# Altium schematic sheet BUS.schdoc: TITRE
size Letter; ApprovedBy: APPROUVÉ PAR; Organization: Cegep Limoilou; Address1: 1300, 8e Avenue; Address2: Québec, QC; Address3: Canada; Address4: G1J 5L5; SheetNumber: 1; SheetTotal: 6
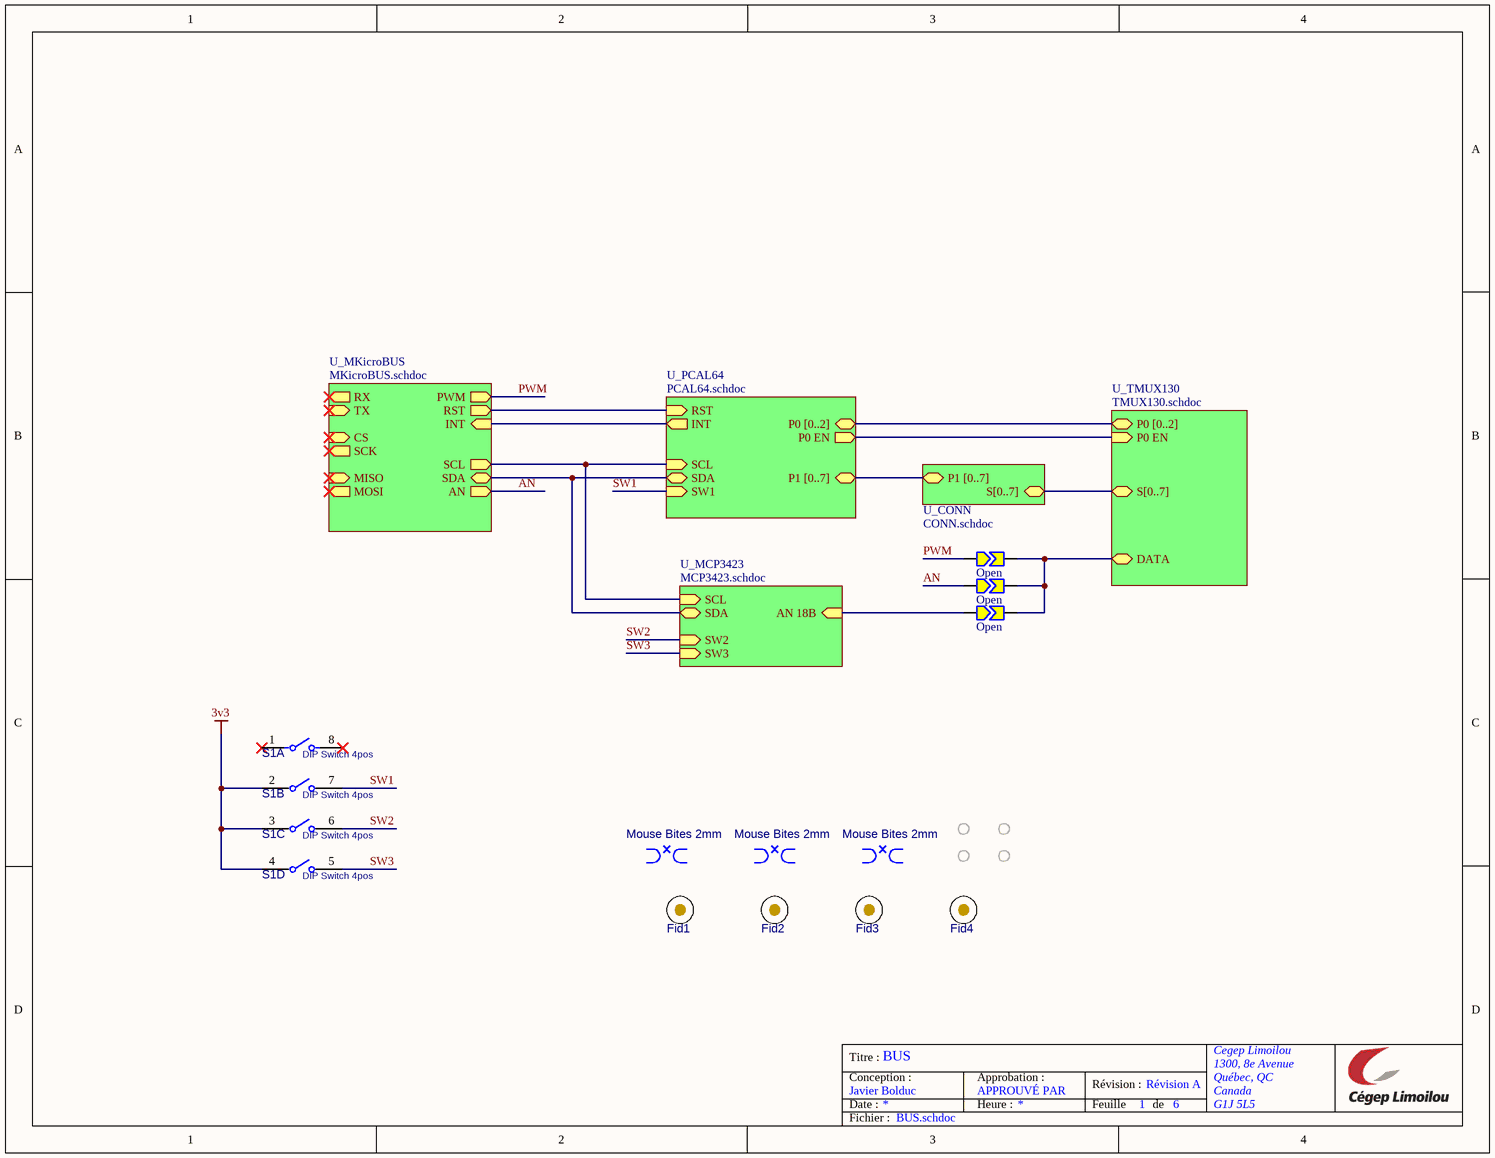
[diagram p0: BUS.schdoc]

## Parts
BRK1  value Mouse Bites 2mm  [BK_CRACK1B_M]  (hidden comment: DNP)  (no BOM)
BRK3  value Mouse Bites 2mm  [BK_CRACK1B_M]  (hidden comment: DNP)  (no BOM)
BRK4  value Mouse Bites 2mm  [BK_CRACK1B_M]  (hidden comment: DNP)  (no BOM)
Fid1  DNP  [FD_Fiducial]  (value not drawn)  (no BOM)
Fid2  DNP  [FD_Fiducial]  (value not drawn)  (no BOM)
Fid3  DNP  [FD_Fiducial]  (value not drawn)  (no BOM)
Fid4  DNP  [FD_Fiducial]  (value not drawn)  (no BOM)
MH1  DNP  [MP_M-Hole_M2-NonPlated]  (value not drawn)  (no BOM)
MH2  DNP  [MP_M-Hole_M2-NonPlated]  (value not drawn)  (no BOM)
MH3  DNP  [MP_M-Hole_M2-NonPlated]  (value not drawn)  (no BOM)
MH4  DNP  [MP_M-Hole_M2-NonPlated]  (value not drawn)  (no BOM)
S1  value DIP Switch 4pos  [S_DIP_SWITCH_50MIL_4POS]  (hidden comment: DSHP04TSGER)  (parts A,B,C,D of 4)
SB1  Open  [SB-TINY-OPEN]  (no BOM)
SB2  Open  [SB-TINY-OPEN]  (no BOM)
SB3  Open  [SB-TINY-OPEN]  (no BOM)

## Sub-sheets
U_CONN = CONN.schdoc: S[0..7] (bidir), P1 [0..7] (bidir)
U_MCP3423 = MCP3423.schdoc: AN 18B (in), SDA (bidir), SCL (in), SW2 (in), SW3 (in)
U_MKicroBUS = MKicroBUS.schdoc: AN (out), INT (in), RST (out), SDA (bidir), SCL (out), MOSI (out), MISO (in), RX (out), TX (in), CS (in), SCK (out), PWM (out)
U_PCAL64 = PCAL64.schdoc: P1 [0..7] (bidir), RST (in), INT (out), SDA (bidir), P0 [0..2] (bidir), P0 EN (out), SCL (in), SW1 (in)
U_TMUX130 = TMUX130.schdoc: S[0..7] (bidir), P0 [0..2] (bidir), P0 EN (in), DATA (bidir)

## Nets
3v3: S1.2 S1.3 S1.4
AN: SB2.1 ; sheet U_MKicroBUS/AN
PWM: SB1.1 ; sheet U_MKicroBUS/PWM
SW1: S1.7 ; sheet U_PCAL64/SW1
SW2: S1.6 ; sheet U_MCP3423/SW2
SW3: S1.5 ; sheet U_MCP3423/SW3
NetSB1_2: SB1.2 SB2.2 SB3.2 ; sheet U_TMUX130/DATA
NetSB3_1: SB3.1 ; sheet U_MCP3423/AN 18B
(unnamed): sheet U_MKicroBUS/INT, sheet U_PCAL64/INT
(unnamed): sheet U_MKicroBUS/RST, sheet U_PCAL64/RST
(unnamed): sheet U_MKicroBUS/SDA, sheet U_PCAL64/SDA, sheet U_MCP3423/SDA
(unnamed): sheet U_MKicroBUS/SCL, sheet U_PCAL64/SCL, sheet U_MCP3423/SCL
(unnamed): sheet U_PCAL64/P0 EN, sheet U_TMUX130/P0 EN

Not connected (* = marked no-connect by the designer): BRK1 1 2 3 4 5; BRK3 1 2 3 4 5; BRK4 1 2 3 4 5; Fid1 1 2 3 4 5; Fid2 1 2 3 4 5; Fid3 1 2 3 4 5; Fid4 1 2 3 4 5; S1 1* 8*

## Buses and harness runs
bus sheet U_CONN/P1 [0..7] = sheet U_PCAL64/P1 [0..7]
bus sheet U_CONN/S[0..7] = sheet U_TMUX130/S[0..7]
bus sheet U_PCAL64/P0 [0..2] = sheet U_TMUX130/P0 [0..2]

## Notes on the sheet
- Titre :
- Conception :
- Date :
- Javier Bolduc
- BUS
- Approbation :
- Heure :
- Révision :
- Feuille
- Révision A
- de
- Fichier :

## Library data of the parts
BRK1 BRK3 BRK4 = BK_BREAKOUT_2MM: Mouse Bites; Mounting Technology: N/A
Fid1-Fid4 = Fiducial: Fiducial mark for alignement and Pick&Place; Value: Fiducial mark; Mounting Technology: N/A
MH1-MH4 = MH-2MM_NP: Mounting Hole 2mm non plated; Manufacturer Part Number 1: DNP; Mounting Technology: N/A; Value: Mounting Hole 2mm non plated; Supplier Part Number 1: N/A
S1 = SW_DIP_50MIL_4POS: SWITCH DIP SLIDE SPST 25MA 24V, pitch 1.27mm, height 1.55mm; Manufacturer 1: kangshen; Manufacturer 2: Omron; Manufacturer Part Number 1: DSHP04TSGER; Manufacturer Part Number 2: A6H-4102-PM; Mounting Technology: SMT; Supplier 1: LCSC; Supplier 2: LCSC; Supplier Part Number 1: C3293144; Supplier Part Number 2: C2733274; Supplier 3: Digikey; Supplier Part Number 3: 39-A6H-4102-PMCT-ND
SB1-SB3 = Solder-Jumper-Open: Solder Jumper